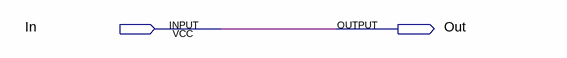
[diagram p0: schematic sheet]
// Quartus schematic Transfer.bdf as structural Verilog: 0 symbols, 2 pins
module Transfer (
  input  In,
  output Out
);


  assign Out = In;
endmodule
